# EAGLE design CCM_0009 (EAGLE 9.5.1)
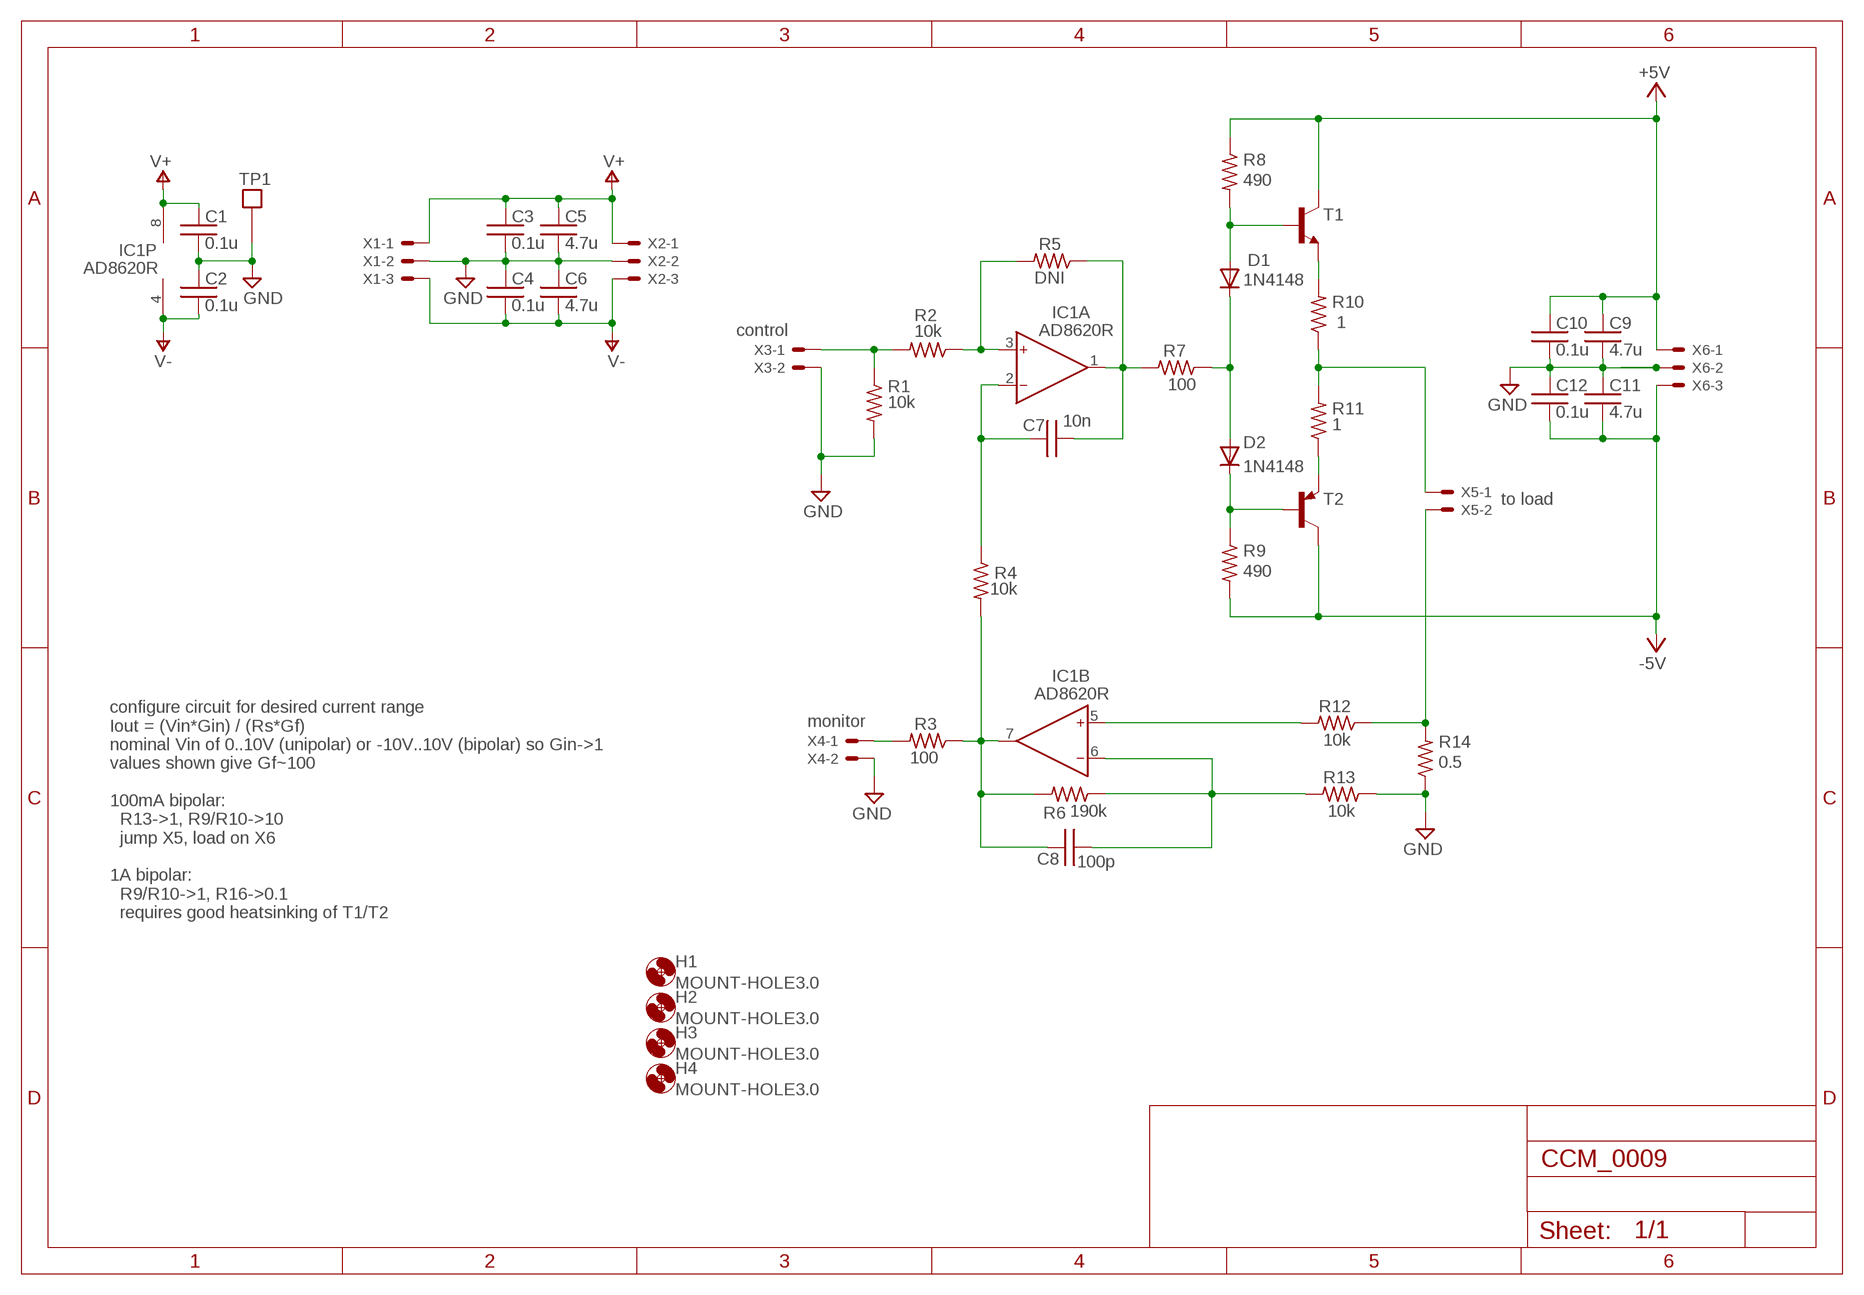
[diagram p0: schematic, sheet 1]

## Parts
C1  0.1u  C0603  [0603]
C2  0.1u  C0603  [0603]
C3  0.1u  C0603  [0603]
C4  0.1u  C0603  [0603]
C5  4.7u  C0603  [0603]
C6  4.7u  C0603  [0603]
C7  10n  C0603  [0603]
C8  100p  C0603  [0603]
C9  4.7u  C0603  [0603]
C10  0.1u  C0603  [0603]
C11  4.7u  C0603  [0603]
C12  0.1u  C0603  [0603]
D1  1N4148  [SOD323_ST]
D2  1N4148  [SOD323_ST]
H1  MOUNT-HOLE3.0  [3,0]
H2  MOUNT-HOLE3.0  [3,0]
H3  MOUNT-HOLE3.0  [3,0]
H4  MOUNT-HOLE3.0  [3,0]
IC1  AD8620R  [SO8]
R1  10k  R0603  [0603]
R2  10k  R0603  [0603]
R3  100  R0603  [0603]
R4  10k  R0603  [0603]
R5  DNI  R0603  [0603]
R6  190k  R0603  [0603]
R7  100  R0603  [0603]
R8  490  R0603  [0603]
R9  490  R0603  [0603]
R10  1  LT030  [LTO30]
R11  1  LT030  [LTO30]
R12  10k  R0603  [0603]
R13  10k  R0603  [0603]
R14  0.5  LT030  [LTO30]
T1  TIP29  -NPN-TO220V  [TO220V]
T2  TIP30  -PNP-TO220V  [TO220V]
TP1  TESTPOINT  [TESTPOINT]
X1  22-23-2031  [22-23-2031]
X2  22-23-2031  [22-23-2031]
X3  22-23-2021  [22-23-2021]
X4  22-23-2021  [22-23-2021]
X5  22-23-2021  [22-23-2021]
X6  22-23-2031  [22-23-2031]

## Nets
+5V: C9.1 C10.1 R8.1 T1.2(C) X6.1
-5V: C11.2 C12.2 R9.2 T2.2(C) X6.3
B: R12.1 R14.P$2 X5.2
GND: C1.2 C2.1 C3.2 C4.1 C5.2 C6.1 C9.2 C10.2 C11.1 C12.1 R1.2 R13.1 R14.P$1 TP1.P$1 X1.2 X2.2 X3.2 X4.2 X6.2
N$1: R11.P$1 T2.3(E)
N$2: R10.P$1 R11.P$2 X5.1
N$3: R10.P$2 T1.3(E)
N$6: C7.2 IC1.1(A:OUT) R5.1 R7.2
N$8: IC1.5(B:IN+) R12.2
N$10: C8.2 IC1.6(B:IN-) R6.1 R13.2
N$11: D1.A R8.2 T1.1(B)
N$12: R3.2 X4.1
N$13: C8.1 IC1.7(B:OUT) R3.1 R4.2 R6.2
N$14: D1.C D2.A R7.1
N$15: C7.1 IC1.2(A:IN-) R4.1
N$16: IC1.3(A:IN+) R2.1 R5.2
N$17: D2.C R9.1 T2.1(B)
N$20: R1.1 R2.2 X3.1
V+: C1.1 C3.1 C5.1 IC1.8(P:V+) X1.1 X2.1
V-: C2.2 C4.2 C6.2 IC1.4(P:V-) X1.3 X2.3

## Notes on the sheet
- control
- to load
- monitor
- configure circuit for desired current range
  Iout = (Vin*Gin) / (Rs*Gf)
  nominal Vin of 0..10V (unipolar) or -10V..10V (bipolar) so Gin->1
  values shown give Gf~100
  
  100mA bipolar:
    R13->1, R9/R10->10
    jump X5, load on X6
  
  1A bipolar:
    R9/R10->1, R16->0.1
    requires good heatsinking of T1/T2

## Library data of the parts
C1-C12 = acrooptics:C: Capacitor
D1 D2 = custom_parts:1N4148: DIODE high speed (Philips)
H1-H4 = holes:MOUNT-HOLE: MOUNTING HOLE with drill center marker
IC1 = analog-devices:AD8620: Precision, Very Low Noise, Low Input Bias Current, Wide Bandwidth JFET Operational Amplifiers Source: http://www.analog.com/static/imported-files/data_sheets/AD8610_8620.pdf; MF: ALTERA CORPORATION; MPN: AD8620ARZ; OC_FARNELL: 9994386; OC_NEWARK: 59K6972
R1-R9 R12 R13 = acrooptics:R: 0603 resistor
R10 R11 R14 = noah:LT030
T1 = transistor:*-NPN-: NPN Transistror BF959 corrected 2008.03.06
T2 = transistor:*-PNP-: PNP Transistror
TP1 = Fitch:TESTPOINT
X1 X2 X6 = con-molex:22-23-2031: .100" (2.54mm) Center Header - 3 Pin; MF: MOLEX; MPN: 22-23-2031; OC_FARNELL: 1462950; OC_NEWARK: 30C0862
X3-X5 = con-molex:22-23-2021: .100" (2.54mm) Center Header - 2 Pin; MF: MOLEX; MPN: 22-23-2021; OC_FARNELL: 1462926; OC_NEWARK: 25C3832

## Net classes
1 standard: width 0.61 mm, clearance 0.254 mm

## Board
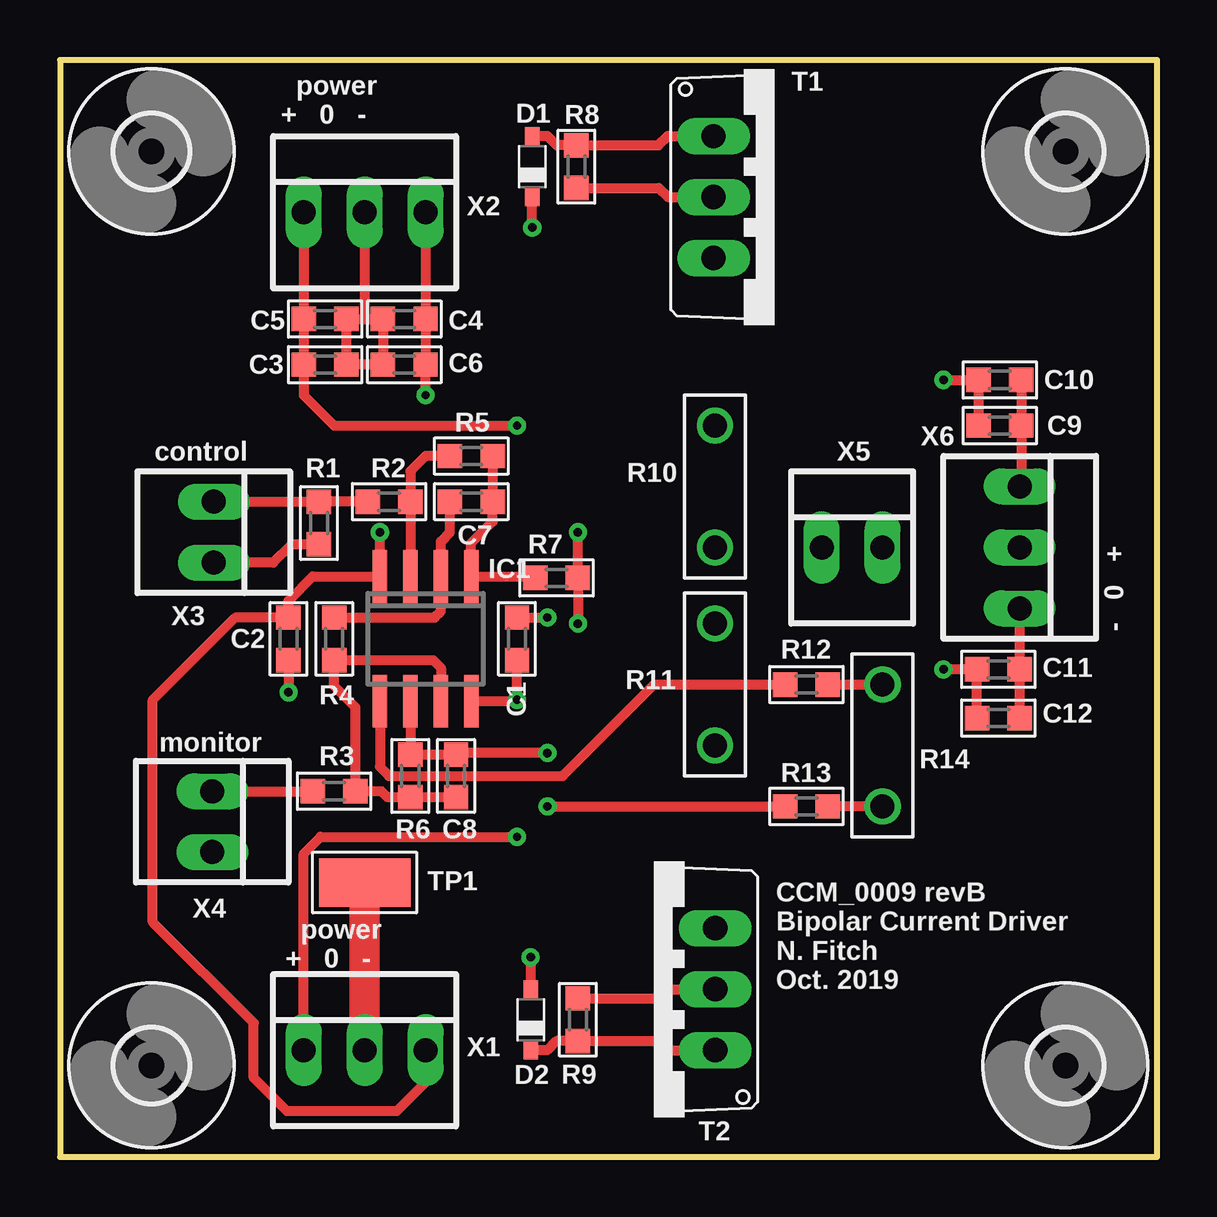
[diagram p1: board, top side]
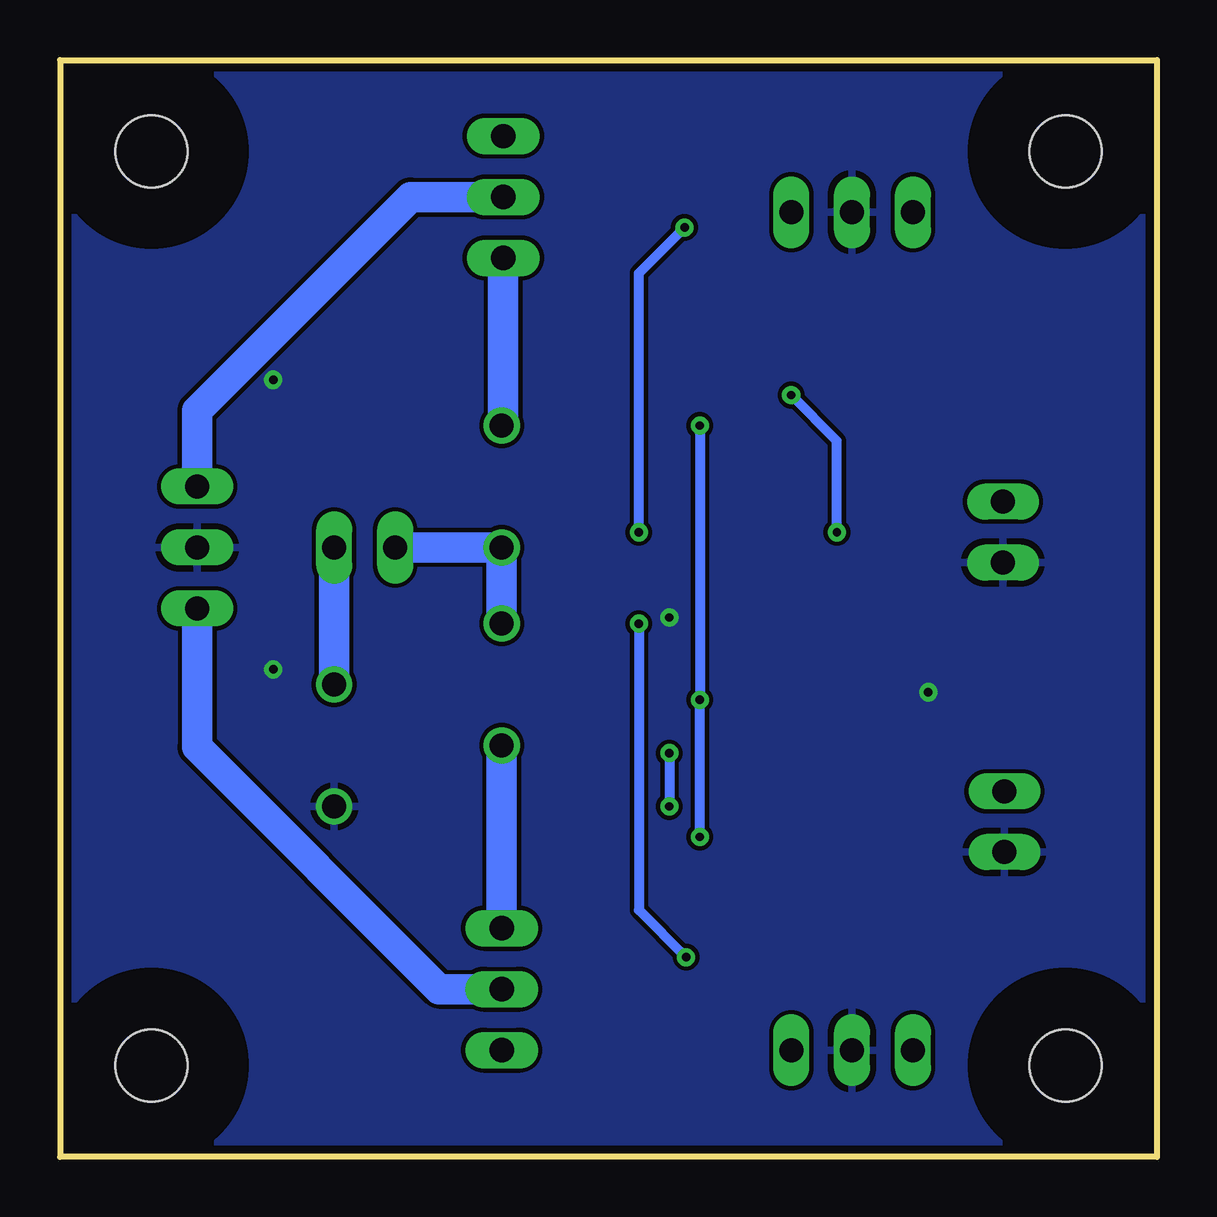
[diagram p2: board, bottom side, seen from below]

Size 45.72 x 45.72 mm. Coordinates in mm from the lower left corner, seen from the top.
Outline: 0,0 45.72,0 45.72,45.72 0,45.72 0,0
Copper layers (1*16): Top 0.035mm / dielectric 1.5mm / Bottom 0.035mm
Design rules "default *": minimum track width 10mil, minimum drill 10mil, track to track 7mil, track to pad 7mil, pad to pad 7mil, via to via 7mil, smd to smd 7mil, copper to edge 10mil, drill to drill 8mil, minimum pad ring 10mil, minimum via ring 8mil, stop-mask expansion 4mil, vias tented up to drill 0mil, thermal gap 10mil

### Footprints (pad centres in the part's own frame; a part is rotated, then mirrored left to right if it is on the bottom)
0603 = smd 1.016 x 1.016: 1 -0.889,0; 2 0.889,0
SOD323_ST = smd 0.8 x 0.6: A 1.25,0; C -1.25,0
3,0 = hole 3: 0,0
SO8 = smd 0.6 x 2.2: 1 -1.905,-2.6; 2 -0.635,-2.6; 3 0.635,-2.6; 4 1.905,-2.6; 5 1.905,2.6; 6 0.635,2.6; 7 -0.635,2.6; 8 -1.905,2.6
LTO30 = drill 1: P$1 0,0; P$2 5.08,0
TO220V = drill 1.016 long: 1 -2.54,-2.54; 2 0,-2.54; 3 2.54,-2.54
TESTPOINT = smd 3.81 x 2.032: P$1 0,0
22-23-2031 = drill 1 long: 1 -2.54,0; 2 0,0; 3 2.54,0
22-23-2021 = drill 1 long: 1 -1.27,0; 2 1.27,0

### Placement (x,y rotation side)
C1  19.05,21.59 90 top
C2  9.53,21.59 90 top
C3  11.05,33.02 0 top
C4  14.35,34.92 0 top
C5  11.05,34.92 0 top
C6  14.35,33.02 0 top
C7  17.14,27.3 0 top
C8  16.51,15.88 90 top
C9  39.18,30.48 180 top
C10  39.18,32.38 180 top
C11  39.12,20.32 0 top
C12  39.12,18.29 0 top
D1  19.68,41.27 90 top
D2  19.62,5.71 90 top
H1  3.81,3.81 0 top
H2  41.91,3.81 0 top
H3  3.81,41.91 0 top
H4  41.91,41.91 0 top
IC1  15.24,21.59 180 top
R1  10.79,26.42 270 top
R2  13.72,27.3 180 top
R3  11.43,15.24 180 top
R4  11.43,21.59 270 top
R5  17.14,29.21 180 top
R6  14.61,15.88 270 top
R7  20.7,24.13 180 top
R8  21.53,41.27 90 top
R9  21.59,5.71 90 top
R10  27.3,25.4 90 top
R11  27.3,17.14 90 top
R12  31.11,19.68 180 top
R13  31.11,14.61 180 top
R14  34.29,14.61 90 top
T1  29.78,40.01 270 top
T2  24.77,6.99 90 top
TP1  12.7,11.43 0 top
X1  12.7,4.45 0 top
X2  12.7,39.37 0 top
X3  6.41,26.04 270 top
X4  6.35,13.97 270 top
X5  33.02,25.4 0 top
X6  40.01,25.4 270 top

### Tracks (layer width: path | path; a pad name or v marks a point on that pad's centre or on a via)
+5V
  Top 0.406: R8.1 24.96,40.39 25.34,40.01 T1.2 | C10.1 C9.1 40.07,28 X6.1
  Bottom 1.27: X6.1 40.01,31.11 31.11,40.01 T1.2
-5V
  Top 0.406: C12.2 C11.2 X6.3 | R9.2 25.02,6.6 25.4,6.99 T2.2
  Bottom 1.27: X6.3 40.01,17.08 29.91,6.99 T2.2
B
  Top 0.406: R12.1 R14.P$2
  Bottom 1.27: R14.P$2 X5.2
GND  (via drill 0.35)
  Top 0.406: 12.7,34.92 C5.2 C3.2 C6.1 C4.1 12.7,34.92 | X2.2 12.7,34.92 | R1.2 9.65,25.53 8.89,24.77 X3.2 | C1.2 v20.32,22.48 | C2.1 v9.53,19.37 | R14.P$1 R13.1 | C12.1 C11.1 v36.83,20.32 | C9.2 C10.2 v36.83,32.38
  Top 1.27: TP1.P$1 X1.2
  pour Bottom: 0.64,0.64 0.64,45.09 45.09,45.09 45.09,0.64
N$1
  Bottom 1.27: R11.P$1 T2.3
N$2
  Bottom 1.27: X5.1 R10.P$1 R11.P$2
N$3
  Bottom 1.27: T1.3 27.24,30.54 R10.P$2
N$6
  Top 0.406: R7.2 19.75,24.19 IC1.1 17.14,25.59 18.03,26.48 C7.2 R5.1
N$8
  Top 0.406: IC1.5 13.34,16.26 13.72,15.88 20.95,15.88 24.77,19.68 R12.2
N$10  (via drill 0.35)
  Top 0.406: IC1.6 R6.1 C8.2 16.57,16.83 v20.32,16.83 | v20.32,14.61 R13.2
  Bottom 0.406: v20.32,16.83 v20.32,14.61
N$11
  Top 0.406: T1.1 25.34,42.55 24.96,42.16 R8.2 20.7,42.16 20.32,42.55 19.7,42.55 D1.A
N$12
  Top 0.406: X4.1 R3.2
N$13
  Top 0.406: IC1.7 15.88,20.38 15.56,20.7 R4.2 11.43,19.62 12.32,18.73 R3.1 13.4,15.24 13.65,14.99 R6.2 C8.1
N$14  (via drill 0.35)
  Top 0.406: v21.59,26.04 R7.1 v21.59,22.23 | v19.68,38.73 D1.C | v19.62,8.32 D2.A
  Bottom 0.406: 21.53,26.1 v21.59,26.04 21.59,36.83 v19.68,38.73 | v21.59,22.23 21.59,10.29 v19.62,8.32
N$15
  Top 0.406: C7.1 16.26,26.04 15.88,25.65 IC1.2 15.88,22.73 15.62,22.48 R4.1
N$16
  Top 0.406: IC1.3 R2.1 14.61,28.57 15.24,29.21 R5.2
N$17
  Top 0.406: T2.1 25.4,4.45 25.02,4.83 R9.1 20.7,4.83 20.32,4.45 19.64,4.45 D2.C
N$20
  Top 0.406: X3.1 R1.1 R2.2
V+  (via drill 0.35)
  Top 0.406: X2.1 C5.1 C3.1 10.16,31.75 11.43,30.48 v19.05,30.48 | IC1.8 18.99,18.99 v19.05,19.05 C1.1 | X1.1 10.16,12.64 10.86,13.34 v19.05,13.34
  Bottom 0.406: v19.05,30.48 v19.05,19.05 v19.05,13.34
V-  (via drill 0.35)
  Top 0.406: X2.3 C4.2 C6.2 v15.24,31.75 | v13.34,26.04 IC1.4 10.54,24.19 9.53,23.18 C2.2 7.3,22.48 3.87,19.05 3.87,9.78 8.08,5.58 8.08,3.29 9.46,1.91 14.03,1.91 15.24,3.11 X1.3
  Bottom 0.406: v13.34,26.04 13.34,29.84 v15.24,31.75

### Text on the board
tPlace: power / + 0 - | control | - 0 + | monitor | power / + 0 - | CCM_0009 revB / Bipolar Current Driver / N. Fitch / Oct. 2019